# Altium schematic sheet Power.SchDoc
size A4
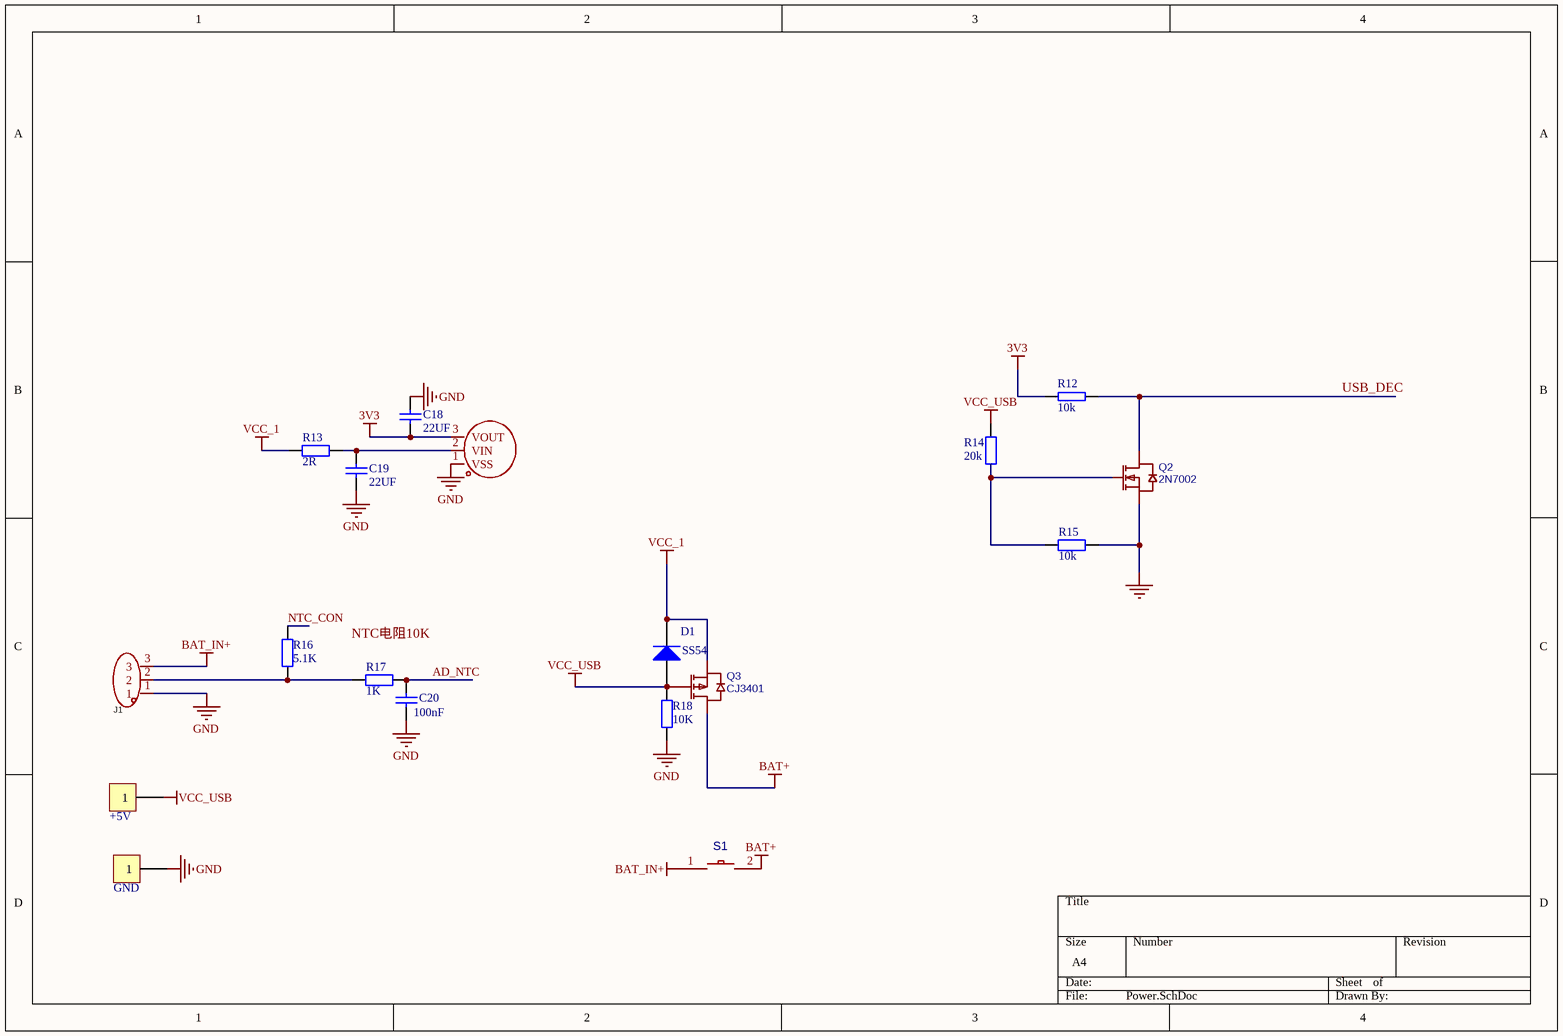
[diagram p0: Power.SchDoc]

## Parts
C18  22UF  [0805_C]
C19  22UF  [0805_C]
C20  100nF  [0603_C]
D1  SS54  [SOD-123FL]
J1  BX-PH2.0-3PZZ  [CONN-TH_3P-P3.96_HX-VH3.96-3P-WZ]  (value not drawn)
P1  +5V  [PAD2]
P2  GND  [PAD2]
Q2  2N7002  [SOT-23]
Q3  CJ3401  [SOT-23]
R12  10k  [0603_R]
R13  2R  [0805_R]
R14  20k  [0603_r]
R15  10k  [0603_r]
R16  5.1K  [0603_R]
R17  1K  [0603_R]
R18  10K  [0603_R]
S1  *  [大按键]  (value not drawn)
U3  me6210a30pg  [SOT-89]  (value not drawn)

## Nets
3V3: C18.1 R12.1 U3.3(VOUT)
BAT+: Q3.3(D) S1.2
BAT_IN+: J1.3 S1.1
GND: C18.2 C19.1 C20.1 J1.1 P2.1 Q2.2(S) R15.1 R18.1 U3.1(VSS)
VCC_1: D1.2(K) Q3.2(S) R13.1
VCC_USB: D1.1(A) P1.1 Q3.1(G) R14.2 R18.2
AD_NTC: C20.2 R17.2
NTC_CON: R16.1
USB_DEC: Q2.3(D) R12.2
NetC19_2: C19.2 R13.2 U3.2(VIN)
NetJ1_2: J1.2 R16.2 R17.1
NetQ2_1: Q2.1(G) R14.1 R15.2

## Notes on the sheet
- Labels drawn without touching a wire or pin: NTC电阻10K

## Library data of the parts
C18-C20 = CAP
D1 = Diode 1N4148: High Conductance Fast Diode; Published: 8-Jun-2000; LatestRevisionDate: 17-Jul-2002; LatestRevisionNote: Re-released for DXP Platform.; DatasheetVersion: 1997; PackageReference: DO-35; Publisher: Altium Limited; PackageDescription: Diode, Axial; Body 3.8 x 1.9 mm (LxDia. max), Lead Dia. 0.53 mm (max); Code_JEDEC: DO-204-AH; ComponentLink1Description: Manufacturer Link; ComponentLink1URL: http://www.fairchildsemi.com/; ComponentLink2Description: Datasheet; ComponentLink2URL: http://www.fairchildsemi.com/ds/1N%2F1N4148.pdf
J1 = BX-PH2.0-3PZZ: Add into BOM: yes; Pins Structure: 1x3P; Pitch: 2mm; Reference Series: PH; Number of PINs Per Row: 3; Current Rating (Max): 2A; Symbol: BX-PH2.0-3PZZ; Device: BX-PH2.0-3PZZ; LCSC Part Name: BX-PH2.0-3PZZ; Supplier Part: C18077745; Manufacturer Part: BX-PH2.0-3PZZ; JLCPCB Part Class: Extended Part; Datasheet: https://atta.szlcsc.com/upload/public/pdf/source/20231017/78B49E88B01779D5C268ECAB29020769.pdf; Supplier: LCSC; Convert to PCB: yes; Number of Pins: 3P; Number of Rows: 1; Row Spacing: -; Comment_1: BX-PH2.0-3PZZ
P1 P2 = CON1
Q2 = JMTL3400A: Contributor: LCSC; BOM_Supplier: LCSC; BOM_Supplier Part: C2890442; BOM_Manufacturer Part: JMTL3400A; BOM_JLCPCB Part Class: Extended Part; spicePre: Q; spiceSymbolName: JMTL3400A
Q3 = CJ3401: BOM_Manufacturer: CJ; BOM_Supplier: LCSC; BOM_Manufacturer Part: CJ3401; BOM_Supplier Part: C13799; BOM_JLCPCB Part Class: Extended Part; spicePre: Q; spiceSymbolName: CJ3401
R12 = RES
R13-R17 = Res1: 贴片电阻
R18 = Res2: Resistor; Value: 120R; Published: 8-Jun-2000; LatestRevisionDate: 17-Jul-2002; LatestRevisionNote: Re-released for DXP Platform.; PackageReference: AXIAL-0.4; Publisher: Altium Limited
S1 = TS-3625SP-2P: Symbol: TS-3625SP-2P
U3 = me6210a30pg: AddInBom: yes; ModelId: 6db690b7897d4d18a30d90c1b89525ee; ModelName: SOT-89-3_L4.3-W2.5-H1.6-LS4.1-P1.50; ModelTransform: 161.417,169.291,0,180,0,0,-18.504,-0.005,0; Voltage - Supply: 18V; Output Voltage: 3V; Output Current: 500mA; standby current: 1.5uA; Number of Outputs: 1; Symbol: ME6210A30PG; LCSC Part Name: 3V 500mA 18V; SupplierPart: C98226; ManufacturerPart: ME6210A30PG; Supplier Footprint: SOT-89; JLCPCB Part Class: Extended Part; Datasheet: https://item.szlcsc.com/datasheet/ME6210A30PG/99435.html; Supplier: LCSC; ConvertToPcb: yes; FootprintName: SOT-89_L4.5-W2.5-P1.50-LS4.2-BR; Power Supply Rejection Ratio (PSRR): -; Noise: -